# Altium project Monitor_Board_Model_H201.PrjPcb (part 3 of 3)

## Sheet Audio_Module.SchDoc: Audio Module
size A4; DocumentNumber: 4; SheetNumber: 4; SheetTotal: 31
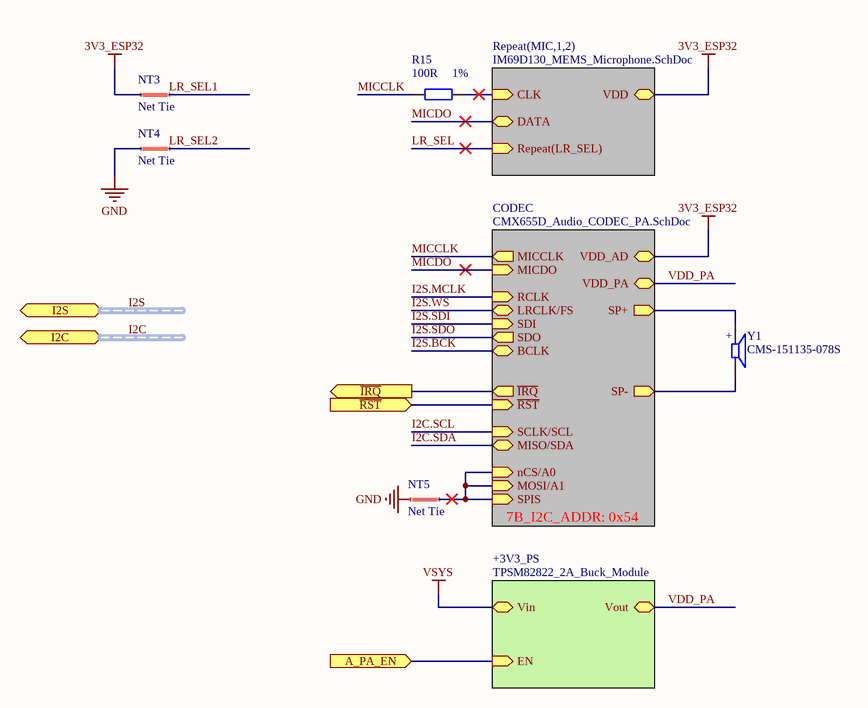
[diagram p10: Audio_Module.SchDoc]

### Parts
NT3  Net Tie  [Net Tie 6x30mil]  (net tie, no BOM)
NT4  Net Tie  [Net Tie 6x30mil]  (net tie, no BOM)
NT5  Net Tie  [Net Tie 6x30mil]  (net tie, no BOM)
R15  Tolerance: 1%  Resistance: 100R  [0402R]  (hidden comment: RES SMD 100 OHM 1% 1/16W 0402)
Y1  CMS-151135-078S  [SPKR_CMS-151135-078S]

### Sub-sheets
+3V3_PS = TPSM82822_2A_Buck_Module (file not in this document): Vout, Vin, EN (in)
CODEC = CMX655D_Audio_CODEC_PA.SchDoc: SP+ (out), SP- (out), VDD_AD, VDD_PA, MICCLK (out), MICDO (in), ~{IRQ} (out), ~{RST} (in), SCLK/SCL (in), MISO/SDA (bidir), MOSI/A1 (in), nCS/A0 (in), SPIS (in), RCLK (in), LRCLK/FS (bidir), SDI (in), SDO (out), BCLK (bidir)  | 7B_I2C_ADDR: 0x54
Repeat(MIC,1,2) = IM69D130_MEMS_Microphone.SchDoc: CLK (in), DATA, VDD, Repeat(LR_SEL) (in)

### Ports
A_PA_EN (in), I2C (harness I2C), I2S (harness I2S), ~{IRQ} (out), ~{RST} (in)

### Nets
3V3_ESP32: NT3.1 ; sheet Repeat(MIC,1,2)/VDD, sheet CODEC/VDD_AD
GND: NT4.1 NT5.1
~{A_IRQ}: port ~{IRQ}, sheet CODEC/~{IRQ}
~{A_RST}: port ~{RST}, sheet CODEC/~{RST}
A_PA_EN: port A_PA_EN, sheet +3V3_PS/EN
LR_SEL: sheet Repeat(MIC,1,2)/Repeat(LR_SEL)
LR_SEL1: NT3.2
LR_SEL2: NT4.2
MICCLK: R15.2 ; sheet CODEC/MICCLK
MICDO: sheet Repeat(MIC,1,2)/DATA, sheet CODEC/MICDO
VDD_PA: sheet CODEC/VDD_PA, sheet +3V3_PS/Vout
NetNT5_2: NT5.2 ; sheet CODEC/MOSI/A1, sheet CODEC/nCS/A0, sheet CODEC/SPIS
NetR15_1: R15.1 ; sheet Repeat(MIC,1,2)/CLK
NetU3_1: Y1.M ; sheet CODEC/SP-
NetU3_23: Y1.P ; sheet CODEC/SP+

### Buses and harness runs
harness I2C = port I2C
harness I2S = port I2S

### Notes on the sheet
- Title
- Size:
- Date:
- A4
- Number:
- Time:
- Revision:
- Sheet
- of
- File:
- (in symbol SPEAKER CMS-151135-078S 15 X 11 MM ENCLOSED) +

### Library data of the parts
NT3-NT5 = Net Tie Line: ClassName: Net Tie
R15 = RES SMD 100 OHM 1% 1/16W 0402: 100 Ohms ±1% 0.063W, 1/16W Chip Resistor 0402 (1005 Metric) Moisture Resistant Thick Film; Manufacturer: Yageo; Manufacturer Part Number: RC0402FR-07100RL; Power Rating: 62.5mW; Voltage Rating: 50V; Temperature Coefficient: 100ppm/°C; Supplier 1: Digi-Key; Stock 1: 16989760; Pricing 1: 1=0.1, 10=0.016, 100=0.0064, 1000=0.0029, 2500=0.0025, 5000=0.0021 (USD); Case/Package: 0402; Number of Pins: 2; Case Code (Imperial): 0402; Case Code (Metric): 1005; Min Operating Temperature: -55°C; Max Operating Temperature: 155°C; Voltage Rating (DC): 50V; Packaging: Tape and Reel; Termination: SMD/SMT; Composition: Thick Film; Military Standard: Not; Length: 1mm; Height: 0.32mm; Width: 0.5mm; Depth: 0.5mm; REACH SVHC: No SVHC; Lead Free: Lead Free; ComponentLink1URL: http://www.farnell.com/datasheets/2167052.pdf?src-supplier=Element14; ComponentLink1Description: http://www.farnell.com/datasheets/2167052.pdf?src-supplier=Element14; ComponentLink2URL: http://www.yageo.com/documents/recent/PYu-RC_Group_51_RoHS_L_9.pdf?src-supplier=Mouser; ComponentLink2Description: http://www.yageo.com/documents/recent/PYu-RC_Group_51_RoHS_L_9.pdf?src-supplier=Mouser; ComponentLink3URL: http://www.yageo.com/documents/recent/PYu-RC0402_51_RoHS_L_6_r.pdf?src-supplier=Future+Electronics; ComponentLink3Description: http://www.yageo.com/documents/recent/PYu-RC0402_51_RoHS_L_6_r.pdf?src-supplier=Future+Electronics; ComponentLink4URL: https://www.verical.com/server-webapp/html/getDatasheet?partID=329466&src-supplier=Verical; ComponentLink4Description: https://www.verical.com/server-webapp/html/getDatasheet?partID=329466&src-supplier=Verical; ComponentLink5URL: http://www.farnell.com/datasheets/1018594.pdf?src-supplier=Element14; ComponentLink5Description: http://www.farnell.com/datasheets/1018594.pdf?src-supplier=Element14; ComponentLink6URL: http://documents.rs-components.com/techlib://itc_doclist_GB.htm?stockno=6185810&src-supplier=RSComponents; ComponentLink6Description: http://documents.rs-components.com/techlib://itc_doclist_GB.htm?stockno=6185810&src-supplier=RSComponents; Supplier Part Number 1: 311-100LRDKR-ND
Y1 = SPEAKER CMS-151135-078S 15 X 11 MM ENCLOSED: 8 Ohms General Purpose Speaker 700mW 100Hz ~ 20kHz Top Rectangular; Manufacturer: CUI; Sensing Method: Magnetic; Self Resonant Frequency: 550Hz; Impedance: 8R; Max Power Dissipation: 1W; Supplier 1: Digi-Key; Manufacturer Part Number: CMS-151135-078S; Stock 1: 1971; Pricing 1: 1=2.07, 10=1.72, 25=1.5888, 50=1.4932, 100=1.4013, 500=1.2016, 1000=1.17 (USD); Packaging: Tray; ComponentLink1URL: https://www.cui.com/product/resource/digikeypdf/CMS-15113-078x.pdf?src-supplier=Digi-Key; ComponentLink1Description: https://www.cui.com/product/resource/digikeypdf/CMS-15113-078x.pdf?src-supplier=Digi-Key; Supplier Part Number 1: 102-4616-ND; Shape: Rectangular; Type: General Purpose; Power Rating: 700mW

## Sheet IM69D130_MEMS_Microphone.SchDoc: IM69D130 PDM MEMS Microphone
size A4; DocumentNumber: 5; SheetNumber: 5; SheetTotal: 31
Used 2 times, as channels AUDIO/MIC1, AUDIO/MIC2. Parts and nets are listed once, with the designators drawn on the sheet.
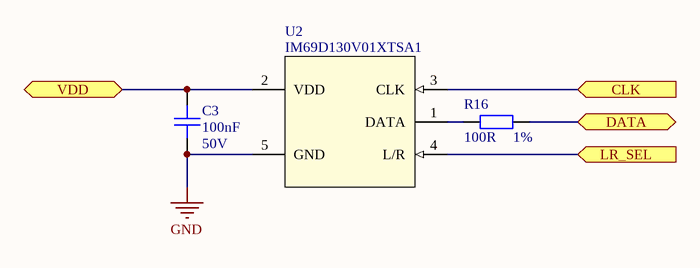
[diagram p11: IM69D130_MEMS_Microphone.SchDoc]

### Parts
C3  Capacitance: 100nF  Voltage: 50V  [C0402]  (hidden comment: CAP CER 0.1UF 50V X7R 0402)
R16  Tolerance: 1%  Resistance: 100R  [0402R]  (hidden comment: RES SMD 100 OHM 1% 1/16W 0402)
U2  IM69D130V01XTSA1  [MIC_IM69D130V01XTSA1]

### Ports
CLK (in), DATA, LR_SEL (in), VDD

### Nets
GND: C3.1 U2.5(GND)
CLK: U2.3(CLK) ; port CLK
DATA: R16.1 ; port DATA
LR_SEL: U2.4(L/R) ; port LR_SEL
VDD: C3.2 U2.2(VDD) ; port VDD
NetR16_2: R16.2 U2.1(DATA)

### Channels
AUDIO/MIC1: designators C3=C16#2 R16=R31#2 U2=U5#2; ports CLK=NetR15_1 DATA=MICDO LR_SEL=LR_SEL1 VDD=3V3_ESP32
AUDIO/MIC2: designators C3=C17#2 R16=R32#2 U2=U6#2; ports CLK=NetR15_1 DATA=MICDO LR_SEL=LR_SEL2 VDD=3V3_ESP32

### Notes on the sheet
- Title
- Size:
- Date:
- A4
- Number:
- Time:
- Revision:
- Sheet
- of
- File:

### Library data of the parts
C3 = CAP CER 0.1UF 50V X7R 0402: 0.1µF ±10% 50V Ceramic Capacitor X7R 0402 (1005 Metric); Manufacturer: TDK; Manufacturer Part Number: CGA2B3X7R1H104K050BB; Supplier 1: Digi-Key; Stock 1: 2925303; Pricing 1: 1=0.17, 10=0.118, 50=0.0668, 100=0.0553, 500=0.0388, 1000=0.0321, 2500=0.0299, 5000=0.0273 (USD); Mount: Surface Mount; Case/Package: 0402; Weight: 2.3E-05oz; Case Code (Metric): 1005; Case Code (Imperial): 0402; Min Operating Temperature: -55°C; Max Operating Temperature: 125°C; Voltage Rating: 50V; Tolerance: 10%; Packaging: Tape and Reel; Package Quantity: 1; Voltage Rating (DC): 50V; Dielectric: X7R; Termination: SMD/SMT; Composition: Ceramic; Length: 1mm; Height: 0.5mm; Width: 0.02inch; Thickness: 0.022inch; Depth: 0.5mm; Ratings: AEC-Q200; REACH SVHC: No SVHC; Lead Free: Lead Free; ComponentLink1URL: http://product.tdk.com/capacitor/mlcc/en/documents/mlccspec_automotive_general_midvoltage_en.pdf?src-supplier=Future+Electronics; ComponentLink1Description: http://product.tdk.com/capacitor/mlcc/en/documents/mlccspec_automotive_general_midvoltage_en.pdf?src-supplier=Future+Electronics; ComponentLink2URL: http://www.farnell.com/datasheets/1807242.pdf?src-supplier=Element14; ComponentLink2Description: http://www.farnell.com/datasheets/1807242.pdf?src-supplier=Element14; ComponentLink3URL: http://www.mouser.com/ds/2/400/lcc_automotive_general_en-843974.pdf?src-supplier=Mouser; ComponentLink3Description: http://www.mouser.com/ds/2/400/lcc_automotive_general_en-843974.pdf?src-supplier=Mouser; ComponentLink4URL: http://www.farnell.com/datasheets/1936565.pdf?src-supplier=Element14; ComponentLink4Description: http://www.farnell.com/datasheets/1936565.pdf?src-supplier=Element14; ComponentLink5URL: http://www.farnell.com/datasheets/1735392.pdf?src-supplier=Element14; ComponentLink5Description: http://www.farnell.com/datasheets/1735392.pdf?src-supplier=Element14; Supplier Part Number 1: 445-6899-1-ND
R16 = RES SMD 100 OHM 1% 1/16W 0402: as R15 on sheet Audio_Module; Supplier 1: Digi-Key; Stock 1: 16989760; Pricing 1: 1=0.1, 10=0.016, 100=0.0064, 1000=0.0029, 2500=0.0025, 5000=0.0021 (USD); Case/Package: 0402; Number of Pins: 2; Case Code (Imperial): 0402; Case Code (Metric): 1005; Min Operating Temperature: -55°C; Max Operating Temperature: 155°C; Voltage Rating (DC): 50V; Packaging: Tape and Reel; Termination: SMD/SMT; Composition: Thick Film; Military Standard: Not; Length: 1mm; Height: 0.32mm; Width: 0.5mm; Depth: 0.5mm; REACH SVHC: No SVHC; Lead Free: Lead Free; ComponentLink1URL: http://www.farnell.com/datasheets/2167052.pdf?src-supplier=Element14; ComponentLink1Description: http://www.farnell.com/datasheets/2167052.pdf?src-supplier=Element14; ComponentLink2URL: http://www.yageo.com/documents/recent/PYu-RC_Group_51_RoHS_L_9.pdf?src-supplier=Mouser; ComponentLink2Description: http://www.yageo.com/documents/recent/PYu-RC_Group_51_RoHS_L_9.pdf?src-supplier=Mouser; ComponentLink3URL: http://www.yageo.com/documents/recent/PYu-RC0402_51_RoHS_L_6_r.pdf?src-supplier=Future+Electronics; ComponentLink3Description: http://www.yageo.com/documents/recent/PYu-RC0402_51_RoHS_L_6_r.pdf?src-supplier=Future+Electronics; ComponentLink4URL: https://www.verical.com/server-webapp/html/getDatasheet?partID=329466&src-supplier=Verical; ComponentLink4Description: https://www.verical.com/server-webapp/html/getDatasheet?partID=329466&src-supplier=Verical; ComponentLink5URL: http://www.farnell.com/datasheets/1018594.pdf?src-supplier=Element14; ComponentLink5Description: http://www.farnell.com/datasheets/1018594.pdf?src-supplier=Element14; ComponentLink6URL: http://documents.rs-components.com/techlib://itc_doclist_GB.htm?stockno=6185810&src-supplier=RSComponents; ComponentLink6Description: http://documents.rs-components.com/techlib://itc_doclist_GB.htm?stockno=6185810&src-supplier=RSComponents; Supplier Part Number 1: 311-100LRDKR-ND
U2 = IC IM69D130 MICROPHONE MEMS DIGITAL PDM OMNI: 20Hz ~ 20kHz Digital, PDM Microphone MEMS (Silicon) 1.62V ~ 3.6V Omnidirectional (-36dB ±1dB @ 94dB SPL) Solder Pads; Manufacturer: Infineon; Shape: Rectangular; Max Frequency: 3.3MHz; Operating Supply Voltage: -3.6V; Operating Supply Current: 1.3mA; Supplier 1: Digi-Key; Manufacturer Part Number: IM69D130V01XTSA1; Stock 1: 16861; Pricing 1: 1=1.76, 10=1.458, 25=1.3476, 50=1.2674, 100=1.19, 500=1.0214 (USD); Output Type: Digital; Direction: Omnidirectional; Packaging: Cut Tape; Termination: Solder; Lead Free: Lead Free; Halogen Free: Halogen Free; RoHS Compliant: Yes; ComponentLink1URL: http://www.farnell.com/datasheets/2718732.pdf?src-supplier=Newark; ComponentLink1Description: http://www.farnell.com/datasheets/2718732.pdf?src-supplier=Newark; ComponentLink2URL: https://www.infineon.com/dgdl/Infineon-IM69D130-DS-v01_00-EN.pdf?fileId=5546d462602a9dc801607a0e46511a2e&src-supplier=Digi-Key; ComponentLink2Description: https://www.infineon.com/dgdl/Infineon-IM69D130-DS-v01_00-EN.pdf?fileId=5546d462602a9dc801607a0e46511a2e&src-supplier=Digi-Key; ComponentLink3URL: http://www.farnell.com/datasheets/2718732.pdf?src-supplier=Farnell; ComponentLink3Description: http://www.farnell.com/datasheets/2718732.pdf?src-supplier=Farnell; Supplier Part Number 1: IM69D130V01XTSA1CT-ND

## Sheet CMX655D_Audio_CODEC_PA.SchDoc: CMX655D Audio CODEC with PA
size A4; DocumentNumber: 6; SheetNumber: 6; SheetTotal: 31
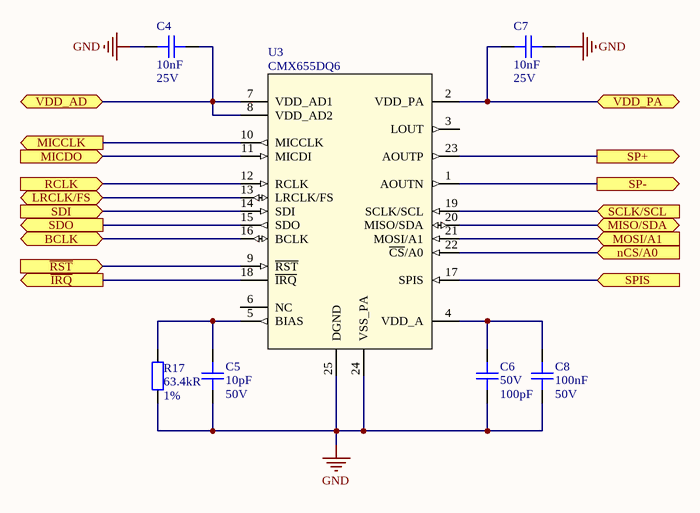
[diagram p12: CMX655D_Audio_CODEC_PA.SchDoc]

### Parts
C4  Capacitance: 10nF  Voltage: 25V  [C0402]  (hidden comment: CAP CER 10nF 25V X7R 10% 0402)
C5  Capacitance: 10pF  Voltage Rating: 50V  [C0402]  (hidden comment: CAP CER 10PF 50V C0G/NP0 0402)
C6  Voltage: 50V  Capacitance: 100pF  [CAP_0402]  (hidden comment: C 100pF 50V C0G, NP0 0402)
C7  Capacitance: 10nF  Voltage: 25V  [C0402]  (hidden comment: CAP CER 10nF 25V X7R 10% 0402)
C8  Capacitance: 100nF  Voltage: 50V  [C0402]  (hidden comment: CAP CER 0.1UF 50V X7R 0402)
R17  Resistance: 63.4kR  Tolerance: 1%  [R_0402]  (hidden comment: RES SMD 63.4K OHM 1% 1/16W 0402)
U3  CMX655DQ6  [QFN50P400X400X100_HS-25N]

### Ports
BCLK (bidir), LRCLK/FS (bidir), MICCLK (out), MICDO (in), MISO/SDA (bidir), MOSI/A1 (in), nCS/A0 (in), RCLK (in), SCLK/SCL (in), SDI (in), SDO (out), SP+ (out), SP- (out), SPIS (in), VDD_AD, VDD_PA, ~{IRQ} (out), ~{RST} (in)

### Nets
3V3_ESP32: C4.2 U3.7(VDD_AD1) U3.8(VDD_AD2) ; port VDD_AD
GND: C4.1 C5.1 C6.1 C7.1 C8.1 R17.2 U3.24(VSS_PA) U3.25(DGND)
~{A_IRQ}: U3.18(~{IRQ}) ; port ~{IRQ}
~{A_RST}: U3.9(~{RST}) ; port ~{RST}
I2C.SCL: U3.19(SCLK/SCL) ; port SCLK/SCL
I2C.SDA: U3.20(MISO/SDA) ; port MISO/SDA
I2S.BCK: U3.16(BCLK) ; port BCLK
I2S.MCLK: U3.12(RCLK) ; port RCLK
I2S.SDI: U3.14(SDI) ; port SDI
I2S.SDO: U3.15(SDO) ; port SDO
I2S.WS: U3.13(LRCLK/FS) ; port LRCLK/FS
MICCLK: U3.10(MICCLK) ; port MICCLK
MICDO: U3.11(MICDI) ; port MICDO
VDD_PA: C7.2 U3.2(VDD_PA) ; port VDD_PA
NetC5_2: C5.2 R17.1 U3.5(BIAS)
NetC6_2: C6.2 C8.2 U3.4(VDD_A)
NetNT5_2: U3.17(SPIS) U3.21(MOSI/A1) U3.22(~{CS}/A0) ; port MOSI/A1, port nCS/A0, port SPIS
NetU3_1: U3.1(AOUTN) ; port SP-
NetU3_23: U3.23(AOUTP) ; port SP+

Not connected (* = marked no-connect by the designer): U3 3(LOUT) 6(NC)

### Notes on the sheet
- Title
- Size:
- Date:
- A4
- Number:
- Time:
- Revision:
- Sheet
- of
- File:

### Library data of the parts
C4 C7 = CAP CER 10nF 25V X7R 10% 0402: Manufacturer: Kyocera AVX; Manufacturer Part Number: 04023C103KAT2A; Dissipation Factor: 12.5%; Insulation Resistance: 100GR; Supplier 1: Digi-Key; Stock 1: 1015537; Pricing 1: 1=0.1, 10=0.034, 50=0.0182, 100=0.0149, 500=0.0107, 1000=0.0084, 2500=0.0076, 5000=0.007 (USD); Mount: Surface Mount,PCB; Case/Package: 0402; Case Code (Metric): 1005; Case Code (Imperial): 0402; Min Operating Temperature: -55°C; Max Operating Temperature: 125°C; Tolerance: 10%; Dielectric: X7R; Voltage Rating (DC): 25V; Packaging: Tape and Reel; Voltage Rating: 25V; Package Quantity: 1; Termination: SMD/SMT; Length: 1mm; Height: 0.56mm; Depth: 0.5mm; Width: 0.02inch; Thickness: 0.022inch; Radiation Hardening: No; REACH SVHC: No SVHC; Lead Free: Lead Free; ComponentLink1URL: http://www.farnell.com/datasheets/2237835.pdf?src-supplier=Element14; ComponentLink1Description: http://www.farnell.com/datasheets/2237835.pdf?src-supplier=Element14; ComponentLink2URL: http://catalogs.avx.com/SurfaceMount.pdf?src-supplier=Digi-Key; ComponentLink2Description: http://catalogs.avx.com/SurfaceMount.pdf?src-supplier=Digi-Key; ComponentLink3URL: http://www.alliedelec.com/m/d/a24bb5190bea413b2ff164816f55e87c.pdf?src-supplier=Allied+Electronics; ComponentLink3Description: http://www.alliedelec.com/m/d/a24bb5190bea413b2ff164816f55e87c.pdf?src-supplier=Allied+Electronics; ComponentLink4URL: http://uk.rs-online.com/webdocs/13ec/0900766b813ece35.pdf?src-supplier=RSComponents; ComponentLink4Description: http://uk.rs-online.com/webdocs/13ec/0900766b813ece35.pdf?src-supplier=RSComponents; Supplier Part Number 1: 478-1113-1-ND
C5 = CAP CER 10PF 50V C0G/NP0 0402: 10pF ±10% 50V Ceramic Capacitor C0G, NP0 0402 (1005 Metric); Manufacturer: KEMET; Manufacturer Part Number: C0402C100K5GACTU; Dissipation Factor: 0.1%; Supplier 1: Digi-Key; Stock 1: 57093; Pricing 1: 1=0.1, 10=0.021, 50=0.0116, 100=0.0095, 500=0.0068, 1000=0.0053, 2500=0.0048, 5000=0.0045 (USD); Mount: Surface Mount; Case/Package: 0402; Case Code (Metric): 1005; Case Code (Imperial): 0402; Dielectric Material: Ceramic; Min Operating Temperature: -55°C; Max Operating Temperature: 125°C; Tolerance: 10%; Packaging: Tape and Reel; Package Quantity: 10000; Voltage Rating (DC): 50V; Dielectric: C0G; Termination: SMD/SMT; Length: 1mm; Height: 0.5mm; Width: 0.02inch; Thickness: 0.022inch; Lead Pitch: 0.3mm; Depth: 0.5mm; Radiation Hardening: No; REACH SVHC: No SVHC; Lead Free: Lead Free; ComponentLink1URL: http://www.mouser.com/ds/2/212/KEM_C1003_C0G_SMD-1101588.pdf?src-supplier=Mouser; ComponentLink1Description: http://www.mouser.com/ds/2/212/KEM_C1003_C0G_SMD-1101588.pdf?src-supplier=Mouser; Supplier Part Number 1: 399-7747-1-ND
C6 = C 100pF 50V C0G, NP0 0402: 100pF ±5% 50V Ceramic Capacitor C0G, NP0 0402 (1005 Metric); Manufacturer: Yageo; Manufacturer Part Number: CC0402JRNPO9BN101; Temperature Coefficient: 30ppm/°C; Insulation Resistance: 100GR; Supplier 1: Digi-Key; Stock 1: 4235236; Pricing 1: 1=0.1, 10=0.02, 100=0.0089, 500=0.0064, 1000=0.005, 2500=0.0046, 5000=0.0042 (USD); Mount: Surface Mount; Case/Package: 0402; Number of Pins: 2; Case Code (Imperial): 0402; Case Code (Metric): 1005; Dielectric Material: Ceramic; Min Operating Temperature: -55°C; Max Operating Temperature: 125°C; Tolerance: 5%; Voltage Rating (DC): 50V; Packaging: Tape and Reel; Package Quantity: 1; Termination: SMD/SMT; Composition: Ceramic; Length: 1mm; Height: 0.5mm; Width: 0.5mm; Thickness: 0.022inch; Depth: 0.5mm; Radiation Hardening: No; REACH SVHC: No SVHC; Lead Free: Lead Free; ComponentLink1URL: http://www.farnell.com/datasheets/2213336.pdf?src-supplier=Newark; ComponentLink1Description: http://www.farnell.com/datasheets/2213336.pdf?src-supplier=Newark; ComponentLink2URL: http://www.yageo.com/documents/recent/UPY-GP_NP0_16V-to-50V_16.pdf?src-supplier=Digi-Key; ComponentLink2Description: http://www.yageo.com/documents/recent/UPY-GP_NP0_16V-to-50V_16.pdf?src-supplier=Digi-Key; ComponentLink3URL: http://documents.rs-components.com/techlib://itc_doclist_GB.htm?stockno=6698684&src-supplier=RSComponents; ComponentLink3Description: http://documents.rs-components.com/techlib://itc_doclist_GB.htm?stockno=6698684&src-supplier=RSComponents; ComponentLink4URL: http://www.yageo.com/documents/recent/UPY-GP_NP0_16V-to-50V_8.pdf?src-supplier=Avnet+Europe; ComponentLink4Description: http://www.yageo.com/documents/recent/UPY-GP_NP0_16V-to-50V_8.pdf?src-supplier=Avnet+Europe; ComponentLink5URL: http://www.farnell.com/datasheets/1443161.pdf?src-supplier=Element14; ComponentLink5Description: http://www.farnell.com/datasheets/1443161.pdf?src-supplier=Element14; ComponentLink6URL: http://www.farnell.com/datasheets/2213336.pdf?src-supplier=Element14; ComponentLink6Description: http://www.farnell.com/datasheets/2213336.pdf?src-supplier=Element14; Supplier Part Number 1: 311-1024-1-ND; Dielectric: C0G; Voltage Rating: 50V
C8 = CAP CER 0.1UF 50V X7R 0402: as C3 on sheet IM69D130_MEMS_Microphone; Supplier 1: Digi-Key; Stock 1: 2925303; Pricing 1: 1=0.17, 10=0.118, 50=0.0668, 100=0.0553, 500=0.0388, 1000=0.0321, 2500=0.0299, 5000=0.0273 (USD); Mount: Surface Mount; Case/Package: 0402; Weight: 2.3E-05oz; Case Code (Metric): 1005; Case Code (Imperial): 0402; Min Operating Temperature: -55°C; Max Operating Temperature: 125°C; Voltage Rating: 50V; Tolerance: 10%; Packaging: Tape and Reel; Package Quantity: 1; Voltage Rating (DC): 50V; Dielectric: X7R; Termination: SMD/SMT; Composition: Ceramic; Length: 1mm; Height: 0.5mm; Width: 0.02inch; Thickness: 0.022inch; Depth: 0.5mm; Ratings: AEC-Q200; REACH SVHC: No SVHC; Lead Free: Lead Free; ComponentLink1URL: http://product.tdk.com/capacitor/mlcc/en/documents/mlccspec_automotive_general_midvoltage_en.pdf?src-supplier=Future+Electronics; ComponentLink1Description: http://product.tdk.com/capacitor/mlcc/en/documents/mlccspec_automotive_general_midvoltage_en.pdf?src-supplier=Future+Electronics; ComponentLink2URL: http://www.farnell.com/datasheets/1807242.pdf?src-supplier=Element14; ComponentLink2Description: http://www.farnell.com/datasheets/1807242.pdf?src-supplier=Element14; ComponentLink3URL: http://www.mouser.com/ds/2/400/lcc_automotive_general_en-843974.pdf?src-supplier=Mouser; ComponentLink3Description: http://www.mouser.com/ds/2/400/lcc_automotive_general_en-843974.pdf?src-supplier=Mouser; ComponentLink4URL: http://www.farnell.com/datasheets/1936565.pdf?src-supplier=Element14; ComponentLink4Description: http://www.farnell.com/datasheets/1936565.pdf?src-supplier=Element14; ComponentLink5URL: http://www.farnell.com/datasheets/1735392.pdf?src-supplier=Element14; ComponentLink5Description: http://www.farnell.com/datasheets/1735392.pdf?src-supplier=Element14; Supplier Part Number 1: 445-6899-1-ND
R17 = RES SMD 63.4K OHM 1% 1/16W 0402: 63.4 kOhms ±1% 0.063W, 1/16W Chip Resistor 0402 (1005 Metric) Moisture Resistant Thick Film; Manufacturer: Yageo; Manufacturer Part Number: RC0402FR-0763K4L; Power Rating: 62.5mW; Voltage Rating: 50V; Temperature Coefficient: 100ppm/°C; Max Power Dissipation: 63mW; Supplier 1: Digi-Key; Stock 1: 453897; Pricing 1: 1=0.1, 10=0.015, 100=0.0062, 1000=0.0028, 2500=0.0024, 5000=0.002 (USD); Case/Package: 0402; Case Code (Imperial): 0402; Case Code (Metric): 1005; Contact Plating: Tin,Matte; Min Operating Temperature: -55°C; Max Operating Temperature: 155°C; Packaging: Tape and Reel; Composition: Thick Film; Number of Terminations: 2; Termination: SMD/SMT; Military Standard: Not; Features: Moisture Resistant; Length: 1mm; Height: 0.016inch; Width: 0.02inch; Depth: 0.5mm; Lead Free: Lead Free; ComponentLink1URL: http://www.yageo.com/documents/recent/PYu-RC0402_51_RoHS_L_6.pdf?src-supplier=Avnet+Europe; ComponentLink1Description: http://www.yageo.com/documents/recent/PYu-RC0402_51_RoHS_L_6.pdf?src-supplier=Avnet+Europe; ComponentLink2URL: http://www.yageo.com/documents/recent/PYu-RC0402_51_RoHS_L_6_r.pdf?src-supplier=Future+Electronics; ComponentLink2Description: http://www.yageo.com/documents/recent/PYu-RC0402_51_RoHS_L_6_r.pdf?src-supplier=Future+Electronics; ComponentLink3URL: http://www.yageo.com/documents/recent/PYu-RC0402_51_RoHS_L_6.pdf?src-supplier=Avnet; ComponentLink3Description: http://www.yageo.com/documents/recent/PYu-RC0402_51_RoHS_L_6.pdf?src-supplier=Avnet; Supplier Part Number 1: YAG3204CT-ND
U3 = IC CMX655DQ6-TR1K VOICE CODEC 16BIT 24VQFN: Voice-Band Interface 16 b I²S, PCM, SPI 24-VQFN (4x4); Manufacturer: CML Microcircuits; Supplier 1: Mouser; Manufacturer Part Number: CMX655DQ6; Stock 1: 164; Pricing 1: 1=1.41, 10=1.41, 50=1.36, 100=1.22, 1000=1.07, 10000=1.01 (USD); Mount: Surface Mount; Case/Package: VQFN; Packaging: Cut Tape; ComponentLink1URL: https://www.cmlmicro.com/wp-content/uploads/2018/10/CMX655_ds.pdf?src-supplier=Digi-Key; ComponentLink1Description: https://www.cmlmicro.com/wp-content/uploads/2018/10/CMX655_ds.pdf?src-supplier=Digi-Key; Supplier Part Number 1: 226-CMX655DQ6; Supplier 2: Digi-Key; Supplier Part Number 2: 2032-1036-1-ND

## Sheet Sensor_Module.SchDoc: Sensor Module
size A4; DocumentNumber: 7; SheetNumber: 7; SheetTotal: 31
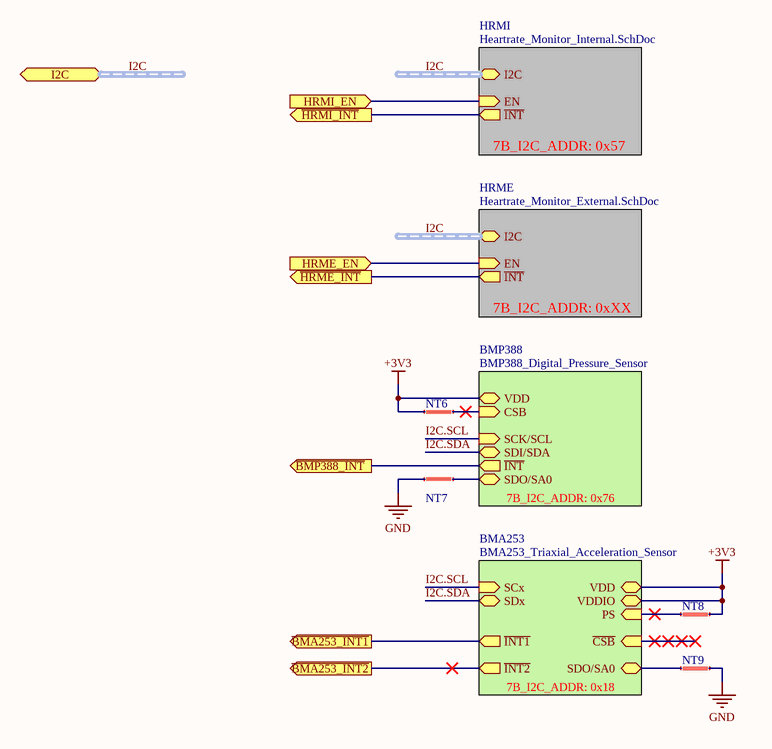
[diagram p13: Sensor_Module.SchDoc]

### Parts
NT6  Net Tie  [Net Tie 6x30mil]  (value not drawn)  (net tie, no BOM)
NT7  Net Tie  [Net Tie 6x30mil]  (value not drawn)  (net tie, no BOM)
NT8  Net Tie  [Net Tie 6x30mil]  (value not drawn)  (net tie, no BOM)
NT9  Net Tie  [Net Tie 6x30mil]  (value not drawn)  (net tie, no BOM)

### Sub-sheets
BMA253 = BMA253_Triaxial_Acceleration_Sensor (file not in this document): ~{INT2} (out), ~{INT1} (out), SCx (in), SDO/SA0, ~{CSB} (in), PS (in), SDx (bidir), VDD, VDDIO  | 7B_I2C_ADDR: 0x18
BMP388 = BMP388_Digital_Pressure_Sensor (file not in this document): VDD, SCK/SCL (in), SDI/SDA (bidir), SDO/SA0 (bidir), CSB (in), ~{INT} (out)  | 7B_I2C_ADDR: 0x76
HRME = Heartrate_Monitor_External.SchDoc: I2C (harness I2C), EN (in), ~{INT} (out)  | 7B_I2C_ADDR: 0xXX
HRMI = Heartrate_Monitor_Internal.SchDoc: I2C (harness I2C), EN (in), ~{INT} (out)  | 7B_I2C_ADDR: 0x57

### Ports
HRME_EN (in), HRMI_EN (in), I2C (harness I2C), ~{BMA253_INT1} (out), ~{BMA253_INT2} (out), ~{BMP388_INT} (out), ~{HRME_INT} (out), ~{HRMI_INT} (out)

### Nets
+3V3: NT6.1 NT8.2 ; sheet BMP388/VDD, sheet BMA253/VDD, sheet BMA253/VDDIO
GND: NT7.2 NT9.2
~{BMA253_INT1}: port ~{BMA253_INT1}, sheet BMA253/~{INT1}
~{BMP388_INT}: port ~{BMP388_INT}, sheet BMP388/~{INT}
~{HRME_INT}: port ~{HRME_INT}, sheet HRME/~{INT}
~{HRMI_INT}: port ~{HRMI_INT}, sheet HRMI/~{INT}
DIO_0: port HRMI_EN, sheet HRMI/EN
DIO_1: port HRME_EN, sheet HRME/EN
I2C.SCL: sheet BMP388/SCK/SCL, sheet BMA253/SCx
I2C.SDA: sheet BMP388/SDI/SDA, sheet BMA253/SDx
NetNT6_2: NT6.2 ; sheet BMP388/CSB
NetNT7_1: NT7.1 ; sheet BMP388/SDO/SA0
NetNT8_1: NT8.1 ; sheet BMA253/PS
NetNT9_1: NT9.1 ; sheet BMA253/SDO/SA0
(unnamed): port ~{BMA253_INT2}, sheet BMA253/~{INT2}

### Buses and harness runs
harness I2C = port I2C
harness I2C = sheet HRME/I2C
harness I2C = sheet HRMI/I2C

### Notes on the sheet
- Title
- Size:
- Date:
- A4
- Number:
- Time:
- Revision:
- Sheet
- of
- File:

### Library data of the parts
NT6-NT9 = Net Tie Line: ClassName: Net Tie

## Sheet Heartrate_Monitor_External.SchDoc: Heart Rate Monitor External
size A4; DocumentNumber: 10; SheetNumber: 10; SheetTotal: 31
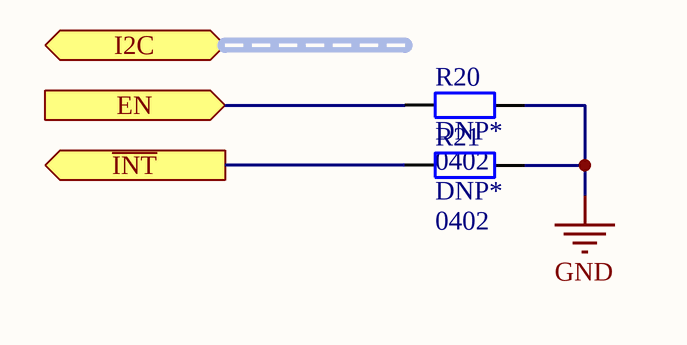
[diagram p14: Heartrate_Monitor_External.SchDoc]

### Parts
R20  DNP*  Case/Package: 0402  [0402R]  (no BOM)
R21  DNP*  Case/Package: 0402  [0402R]  (no BOM)

### Ports
EN (in), I2C (harness I2C), ~{INT} (out)

### Nets
GND: R20.1 R21.1
~{HRME_INT}: R21.2 ; port ~{INT}
DIO_1: R20.2 ; port EN

### Notes on the sheet
- Title
- Size:
- Date:
- A4
- Number:
- Time:
- Revision:
- Sheet
- of
- File:

### Library data of the parts
R20 R21 = RES SMD NO BOM 0402: Placeholder for a 0402 resistor

## Sheet Heartrate_Monitor_Internal.SchDoc: Heart Rate Monitor Internal
size A4; DocumentNumber: 8; SheetNumber: 8; SheetTotal: 31
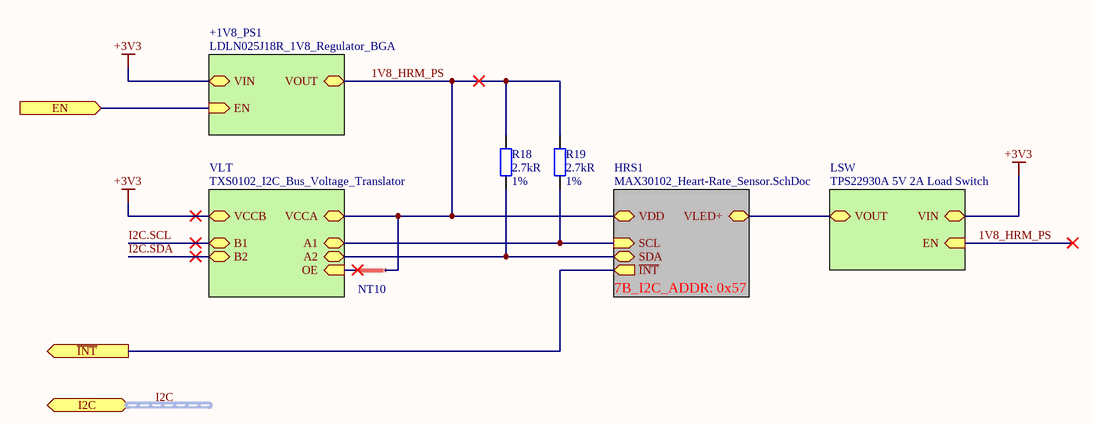
[diagram p15: Heartrate_Monitor_Internal.SchDoc]

### Parts
NT10  Net Tie  [Net Tie 6x30mil]  (value not drawn)  (net tie, no BOM)
R18  Resistance: 2.7kR  Tolerance: 1%  [R0402]  (hidden comment: RES SMD 2.7K OHM 1% 1/16W 0402)
R19  Resistance: 2.7kR  Tolerance: 1%  [R0402]  (hidden comment: RES SMD 2.7K OHM 1% 1/16W 0402)

### Sub-sheets
+1V8_PS1 = LDLN025J18R_1V8_Regulator_BGA (file not in this document): EN (in), VIN, VOUT
HRS1 = MAX30102_Heart-Rate_Sensor.SchDoc: ~{INT} (out), VDD, SCL (in), VLED+, SDA (bidir)  | 7B_I2C_ADDR: 0x57
LSW = TPS22930A 5V 2A Load Switch (file not in this document): EN (in), VOUT, VIN
VLT = TXS0102_I2C_Bus_Voltage_Translator (file not in this document): VCCA, VCCB, OE (in), A1 (bidir), A2 (bidir), B1 (bidir), B2 (bidir)

### Ports
EN (in), I2C (harness I2C), ~{INT} (out)

### Nets
+3V3: sheet +1V8_PS1/VIN, sheet VLT/VCCB, sheet LSW/VIN
1V8_HRM_PS: NT10.2 R18.2 R19.2 ; sheet HRS1/VDD, sheet +1V8_PS1/VOUT, sheet VLT/VCCA, sheet LSW/EN
~{HRMI_INT}: port ~{INT}, sheet HRS1/~{INT}
DIO_0: port EN, sheet +1V8_PS1/EN
I2C.SCL: sheet VLT/B1
I2C.SDA: sheet VLT/B2
NetC9_2: sheet HRS1/VLED+, sheet LSW/VOUT
NetNT10_1: NT10.1 ; sheet VLT/OE
NetR18_1: R18.1 ; sheet HRS1/SDA, sheet VLT/A2
NetR19_1: R19.1 ; sheet HRS1/SCL, sheet VLT/A1

### Buses and harness runs
harness I2C = port I2C

### Notes on the sheet
- Title
- Size:
- Date:
- A4
- Number:
- Time:
- Revision:
- Sheet
- of
- File:

### Library data of the parts
NT10 = Net Tie Line: ClassName: Net Tie
R18 R19 = RES SMD 2.7K OHM 1% 1/16W 0402: 2.7 kOhms ±1% 0.063W, 1/16W Chip Resistor 0402 (1005 Metric) Moisture Resistant Thick Film; Manufacturer Part Number: RC0402FR-072K7L; Manufacturer: Yageo; Temperature Coefficient: 100ppm/°C; Voltage Rating: 50V; Power Rating: 63mW; Supplier 1: Digi-Key; Stock 1: 261850; Pricing 1: 1=0.1, 10=0.016, 100=0.0064, 1000=0.0029, 2500=0.0025, 5000=0.0021 (USD); Case Code (Imperial): 0402; Case Code (Metric): 1005; Min Operating Temperature: -55°C; Max Operating Temperature: 155°C; Composition: Thick Film; Packaging: Tape and Reel; Termination: SMD/SMT; Military Standard: Not; Working Voltage: 50V; Number of Terminations: 2; Length: 1mm; Height: 0.016inch; Width: 0.02inch; Depth: 0.5mm; REACH SVHC: Unknown; Lead Free: Lead Free; ComponentLink1URL: http://www.mouser.com/ds/2/447/PYu-RC0402_51_RoHS_L_6_r-8721.pdf?src-supplier=Mouser; ComponentLink1Description: http://www.mouser.com/ds/2/447/PYu-RC0402_51_RoHS_L_6_r-8721.pdf?src-supplier=Mouser; ComponentLink2URL: http://www.yageo.com/documents/recent/PYu-RC_Group_51_RoHS_L_9.pdf?src-supplier=Digi-Key; ComponentLink2Description: http://www.yageo.com/documents/recent/PYu-RC_Group_51_RoHS_L_9.pdf?src-supplier=Digi-Key; ComponentLink3URL: http://www.yageo.com/documents/recent/PYu-RC_Group_51_RoHS_L_10.pdf?src-supplier=Digi-Key; ComponentLink3Description: http://www.yageo.com/documents/recent/PYu-RC_Group_51_RoHS_L_10.pdf?src-supplier=Digi-Key; ComponentLink4URL: http://www.farnell.com/datasheets/2167052.pdf?src-supplier=Element14; ComponentLink4Description: http://www.farnell.com/datasheets/2167052.pdf?src-supplier=Element14; Supplier Part Number 1: 311-2.70KLRCT-ND; Case/Package: 0402; Package Quantity: 1; Max Power Dissipation: 63mW; Features: Moisture Resistant; ClassName: U_ESP32-WROOM32D_Module

## Sheet MAX30102_Heart-Rate_Sensor.SchDoc: MAX30102 Heart-Rate Sensor
size A4; DocumentNumber: 9; SheetNumber: 9; SheetTotal: 31
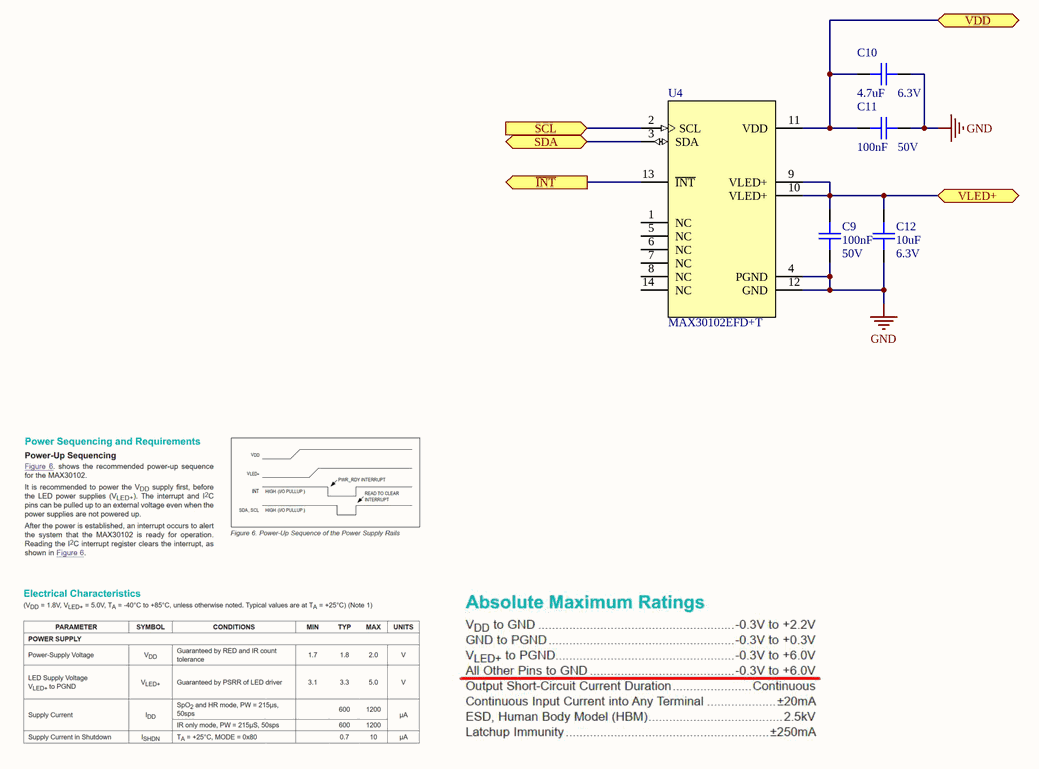
[diagram p16: MAX30102_Heart-Rate_Sensor.SchDoc]

### Parts
C9  Capacitance: 100nF  Voltage: 50V  [C0402]  (hidden comment: CAP CER 0.1UF 50V X7R 0402)
C10  Capacitance: 4.7uF  Voltage Rating: 6.3V  [C0402]  (hidden comment: CAP CER 4.7UF 6.3V X5R 0402)
C11  Capacitance: 100nF  Voltage: 50V  [C0402]  (hidden comment: CAP CER 0.1UF 50V X7R 0402)
C12  Capacitance: 10uF  Voltage Rating: 6.3V  [C0402]  (hidden comment: CAP CER 10UF 6.3V X5R 0402)
U4  MAX30102EFD+T  [XDCR_MAX30101EFD+]

### Ports
SCL (in), SDA (bidir), VDD, VLED+, ~{INT} (out)

### Nets
GND: C9.1 C10.2 C11.2 C12.1 U4.4(PGND) U4.12(GND)
1V8_HRM_PS: C10.1 C11.1 U4.11(VDD) ; port VDD
~{HRMI_INT}: U4.13(~{INT}) ; port ~{INT}
NetC9_2: C9.2 C12.2 U4.9(VLED+) U4.10(VLED+) ; port VLED+
NetR18_1: U4.3(SDA) ; port SDA
NetR19_1: U4.2(SCL) ; port SCL

Not connected (* = marked no-connect by the designer): U4 1(NC) 5(NC) 6(NC) 7(NC) 8(NC) 14(NC)

### Notes on the sheet
- Title
- Size:
- Date:
- A4
- Number:
- Time:
- Revision:
- Sheet
- of
- File:

### Library data of the parts
C9 C11 = CAP CER 0.1UF 50V X7R 0402: as C3 on sheet IM69D130_MEMS_Microphone; Supplier 1: Digi-Key; Stock 1: 2925303; Pricing 1: 1=0.17, 10=0.118, 50=0.0668, 100=0.0553, 500=0.0388, 1000=0.0321, 2500=0.0299, 5000=0.0273 (USD); Mount: Surface Mount; Case/Package: 0402; Weight: 2.3E-05oz; Case Code (Metric): 1005; Case Code (Imperial): 0402; Min Operating Temperature: -55°C; Max Operating Temperature: 125°C; Voltage Rating: 50V; Tolerance: 10%; Packaging: Tape and Reel; Package Quantity: 1; Voltage Rating (DC): 50V; Dielectric: X7R; Termination: SMD/SMT; Composition: Ceramic; Length: 1mm; Height: 0.5mm; Width: 0.02inch; Thickness: 0.022inch; Depth: 0.5mm; Ratings: AEC-Q200; REACH SVHC: No SVHC; Lead Free: Lead Free; ComponentLink1URL: http://product.tdk.com/capacitor/mlcc/en/documents/mlccspec_automotive_general_midvoltage_en.pdf?src-supplier=Future+Electronics; ComponentLink1Description: http://product.tdk.com/capacitor/mlcc/en/documents/mlccspec_automotive_general_midvoltage_en.pdf?src-supplier=Future+Electronics; ComponentLink2URL: http://www.farnell.com/datasheets/1807242.pdf?src-supplier=Element14; ComponentLink2Description: http://www.farnell.com/datasheets/1807242.pdf?src-supplier=Element14; ComponentLink3URL: http://www.mouser.com/ds/2/400/lcc_automotive_general_en-843974.pdf?src-supplier=Mouser; ComponentLink3Description: http://www.mouser.com/ds/2/400/lcc_automotive_general_en-843974.pdf?src-supplier=Mouser; ComponentLink4URL: http://www.farnell.com/datasheets/1936565.pdf?src-supplier=Element14; ComponentLink4Description: http://www.farnell.com/datasheets/1936565.pdf?src-supplier=Element14; ComponentLink5URL: http://www.farnell.com/datasheets/1735392.pdf?src-supplier=Element14; ComponentLink5Description: http://www.farnell.com/datasheets/1735392.pdf?src-supplier=Element14; Supplier Part Number 1: 445-6899-1-ND
C10 = CAP CER 4.7UF 6.3V X5R 0402: 4.7µF ±20% 6.3V Ceramic Capacitor X5R 0402 (1005 Metric); Manufacturer: Samsung; Manufacturer Part Number: CL05A475MQ5NRNC; Supplier 1: Digi-Key; Stock 1: 746765; Pricing 1: 1=0.14, 10=0.099, 50=0.0564, 100=0.0467, 500=0.0327, 1000=0.0271, 2500=0.0252, 5000=0.0231 (USD); Mount: Surface Mount; Case/Package: 0402; Case Code (Metric): 1005; Case Code (Imperial): 0402; Min Operating Temperature: -55°C; Max Operating Temperature: 85°C; Tolerance: 20%; Packaging: Tape and Reel; Series: CL; Length: 0.039inch; Width: 0.02inch; Thickness: 0.022inch; RoHS Compliant: Yes; ComponentLink1URL: https://www.verical.com/server-webapp/html/getDatasheet?partID=359681&src-supplier=Verical; ComponentLink1Description: https://www.verical.com/server-webapp/html/getDatasheet?partID=359681&src-supplier=Verical; ComponentLink2URL: http://www1.futureelectronics.com/doc/SAMSUNG/CL05A475MQ5NRNC.pdf?src-supplier=Future+Electronics; ComponentLink2Description: http://www1.futureelectronics.com/doc/SAMSUNG/CL05A475MQ5NRNC.pdf?src-supplier=Future+Electronics; Supplier Part Number 1: 1276-1056-1-ND
C12 = CAP CER 10UF 6.3V X5R 0402: 10µF ±20% 6.3V Ceramic Capacitor X5R 0402 (1005 Metric); Manufacturer: Samsung; Manufacturer Part Number: CL05A106MQ5NUNC; Supplier 1: Digi-Key; Stock 1: 1544395; Pricing 1: 1=0.27, 10=0.187, 50=0.1248, 100=0.1061, 500=0.0749, 1000=0.0655, 2500=0.0624, 5000=0.0577 (USD); Mount: Surface Mount; Case/Package: 0402; Case Code (Metric): 1005; Case Code (Imperial): 0402; Min Operating Temperature: -55°C; Max Operating Temperature: 85°C; Tolerance: 20%; Dielectric: X5R; Packaging: Tape and Reel; Package Quantity: 1; Series: CL; Construction: Flat; Length: 1mm; Width: 0.02inch; Height: 0.5mm; Thickness: 0.028inch; Depth: 0.5mm; Radiation Hardening: No; ComponentLink1URL: https://www.verical.com/server-webapp/html/getDatasheet?partID=355289&src-supplier=Verical; ComponentLink1Description: https://www.verical.com/server-webapp/html/getDatasheet?partID=355289&src-supplier=Verical; ComponentLink2URL: http://www1.futureelectronics.com/doc/SAMSUNG/CL05A106MQ5NUNC.pdf?src-supplier=Future+Electronics; ComponentLink2Description: http://www1.futureelectronics.com/doc/SAMSUNG/CL05A106MQ5NUNC.pdf?src-supplier=Future+Electronics; Supplier Part Number 1: 1276-1451-1-ND
U4 = IC MAX30102EFD+T INTEGRATED OPTICAL SENSOR: Oximeter/Heart Rate Sensor IÂ²C Output; Manufacturer: Maxim; Output Type: I2C; Supplier 1: Digi-Key; Manufacturer Part Number: MAX30102EFD+T; Stock 1: 4064; Pricing 1: 1=9.76, 10=8.815, 25=8.61 (USD); Min Operating Temperature: -40°C; Max Operating Temperature: 85°C; RoHS Compliant: Yes; ComponentLink1URL: https://datasheets.maximintegrated.com/en/ds/MAX30102.pdf?src-supplier=Digi-Key; ComponentLink1Description: https://datasheets.maximintegrated.com/en/ds/MAX30102.pdf?src-supplier=Digi-Key; Supplier Part Number 1: MAX30102EFD+TCT-ND

## Nets that join several sheets
3V3_ESP32: Test_Points (TP5.1), bq25157_Battery_Charger (C18.1 U7.E1 U7.E4), ESP32_MCU (R7.2 R8.2), SIT1533_Oscillator (C2.2 U1.4), Audio_Module (NT3.1), AUDIO/MIC1 (C16#2.2 U5#2.2), AUDIO/MIC2 (C17#2.2 U6#2.2), CMX655D_Audio_CODEC_PA (C4.2 U3.7 U3.8)
+3V3: Test_Points (TP6.1), bq25157_Battery_Charger (C19.1 U7.D4), ESP32_MCU (NT2.2 R13.2 R14.2), Sensor_Module (NT6.1 NT8.2)
GND: Test_Points (7 pins), Power_Domain (D1.2 D2.2 X1.3), Micro_USB_Port (6 pins), bq25157_Battery_Charger (8 pins), Membrane_Keypad (6 pins), Auxiliary (MNT1.1 MNT2.1 MNT3.1 MNT4.1), ESP32_MCU (6 pins), SIT1533_Oscillator (C2.1 U1.2), Audio_Module (NT4.1 NT5.1), AUDIO/MIC1 (C16#2.1 U5#2.5), AUDIO/MIC2 (C17#2.1 U6#2.5), CMX655D_Audio_CODEC_PA (8 pins), Sensor_Module (NT7.2 NT9.2), Heartrate_Monitor_External (R20.1 R21.1), MAX30102_Heart-Rate_Sensor (6 pins)
VBUS: Test_Points (TP8.1), Micro_USB_Port (C13.2 C14.2 D3.1 X2.1), bq25157_Battery_Charger (C16#1.2 U7.A1)
VSYS: Test_Points (TP7.1), Power_Domain (NT11.2), bq25157_Battery_Charger (C17#1.1 U7.A2 U7.B2), Visual_User_Interface (D4.A)
1V8_HRM_PS: Heartrate_Monitor_Internal (NT10.2 R18.2 R19.2), MAX30102_Heart-Rate_Sensor (C10.1 C11.1 U4.11)
1V8_VDD: bq25157_Battery_Charger (C20.2 U7.D1), Membrane_Keypad (R22.2)
~{MR}: bq25157_Battery_Charger (U7.C1), Membrane_Keypad (U6#1.5 X3.8)
ADCIN: bq25157_Battery_Charger (U7.C4), Membrane_Keypad (9 pins)
LR_SEL1: Audio_Module (NT3.2), AUDIO/MIC1 (U5#2.4)
LR_SEL2: Audio_Module (NT4.2), AUDIO/MIC2 (U6#2.4)
MICCLK: Audio_Module (R15.2), CMX655D_Audio_CODEC_PA (U3.10)
MICDO: AUDIO/MIC1 (R31#2.1), AUDIO/MIC2 (R32#2.1), CMX655D_Audio_CODEC_PA (U3.11)
NetD1_1: Power_Domain (D1.1 X1.1), bq25157_Battery_Charger (U7.A3 U7.B3)
NetD2_1: Power_Domain (D2.1 X1.2), bq25157_Battery_Charger (R30.2 U7.B4)
NetNT5_2: Audio_Module (NT5.2), CMX655D_Audio_CODEC_PA (U3.17 U3.21 U3.22)
NetR15_1: Audio_Module (R15.1), AUDIO/MIC1 (U5#2.3), AUDIO/MIC2 (U6#2.3)
NetR18_1: Heartrate_Monitor_Internal (R18.1), MAX30102_Heart-Rate_Sensor (U4.3)
NetR19_1: Heartrate_Monitor_Internal (R19.1), MAX30102_Heart-Rate_Sensor (U4.2)
NetU3_1: Audio_Module (Y1.M), CMX655D_Audio_CODEC_PA (U3.1)
NetU3_23: Audio_Module (Y1.P), CMX655D_Audio_CODEC_PA (U3.23)